# Altium project YarnControl_Connect_v1.1.PrjPCB
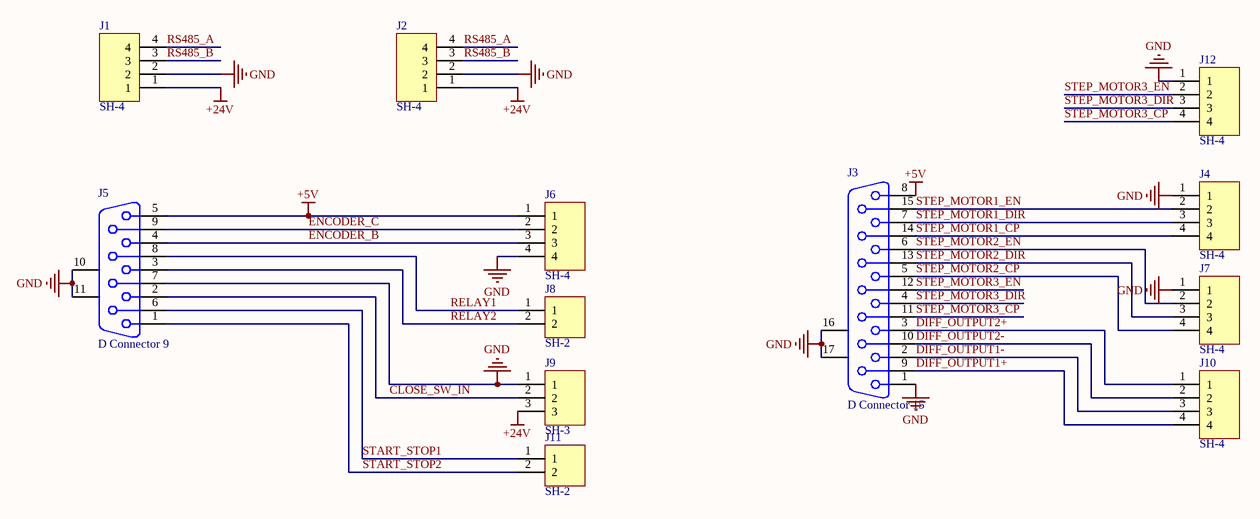
[diagram p0: YarnControl_Connect_v1.1.SchDoc]
1 sheet, 12 parts. Net scope: global (net labels, ports and power ports of the same name join across sheets).
Board file: YarnControl_Connect_v1.1.PcbDoc

## Sheet YarnControl_Connect_v1.1.SchDoc
size A2

### Parts
J1  SH-4  [PWR]
J2  SH-4  [PWR]
J3  D Connector 15  [DSUB1.385-2H15]
J4  SH-4  [PWR]
J5  D Connector 9  [DSUB1.385-2H9]
J6  SH-4  [PWR]
J7  SH-4  [PWR]
J8  SH-2  [J508-2(1)]
J9  SH-3  [J508-3]
J10  SH-4  [PWR]
J11  SH-2  [J508-2(1)]
J12  SH-4  [PWR]

### Nets
+5V: J3.8 J5.5 J6.1
+24V: J1.1 J2.1 J9.3
GND: J1.2 J2.2 J3.1 J3.16(MH1) J3.17(MH2) J4.1 J5.7 J5.10(MH1) J5.11(MH2) J6.4 J7.1 J9.1 J12.1
CLOSE_SW_IN: J5.2 J9.2
DIFF_OUTPUT1+: J3.9 J10.4
DIFF_OUTPUT1-: J3.2 J10.3
DIFF_OUTPUT2+: J3.3 J10.1
DIFF_OUTPUT2-: J3.10 J10.2
ENCODER_B: J5.4 J6.3
ENCODER_C: J5.9 J6.2
RELAY1: J5.8 J8.1
RELAY2: J5.3 J8.2
RS485_A: J1.4 J2.4
RS485_B: J1.3 J2.3
START_STOP1: J5.6 J11.1
START_STOP2: J5.1 J11.2
STEP_MOTOR1_CP: J3.14 J4.4
STEP_MOTOR1_DIR: J3.7 J4.3
STEP_MOTOR1_EN: J3.15 J4.2
STEP_MOTOR2_CP: J3.5 J7.4
STEP_MOTOR2_DIR: J3.13 J7.3
STEP_MOTOR2_EN: J3.6 J7.2
STEP_MOTOR3_CP: J3.11 J12.4
STEP_MOTOR3_DIR: J3.4 J12.3
STEP_MOTOR3_EN: J3.12 J12.2

### Library data of the parts
J3 = D Connector 15: Receptacle Assembly, 15 Position, Right Angle; PackageDocument: O; Positions: 15; Published: 15-Jun-2001; LatestRevisionDate: 17-Jul-2002; LatestRevisionNote: Re-released for DXP Platform.; DatasheetDocument: 1-Sep-99; PackageReference: 788757; Publisher: Altium Limited; Orientation: Right Angle; Gender: Receptacle
J5 = D Connector 9: Receptacle Assembly, 9 Position, Right Angle; PackageDocument: O; Positions: 9; Published: 15-Jun-2001; LatestRevisionDate: 17-Jul-2002; LatestRevisionNote: Re-released for DXP Platform.; DatasheetDocument: 1-Sep-1999; PackageReference: 788750; Publisher: Altium Limited; Orientation: Right Angle; Gender: Receptacle